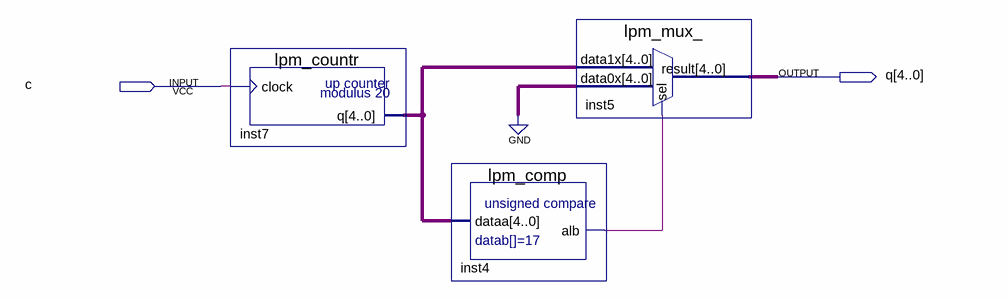
[diagram p0: schematic sheet]
// Quartus schematic 6.bdf as structural Verilog: 3 symbols, 2 pins
module \6  (
  input  c,
  output [4:0] q
);

  wire inst4_alb;
  wire [4:0] inst7_q;

  lpm_countr inst7 (.clock(c), .q(inst7_q));
  lpm_comp inst4 (.dataa(inst7_q), .alb(inst4_alb));
  lpm_mux_ inst5 (.data1x(inst7_q), .data0x({5{1'b0}}), .sel(inst4_alb), .result(q));
endmodule
